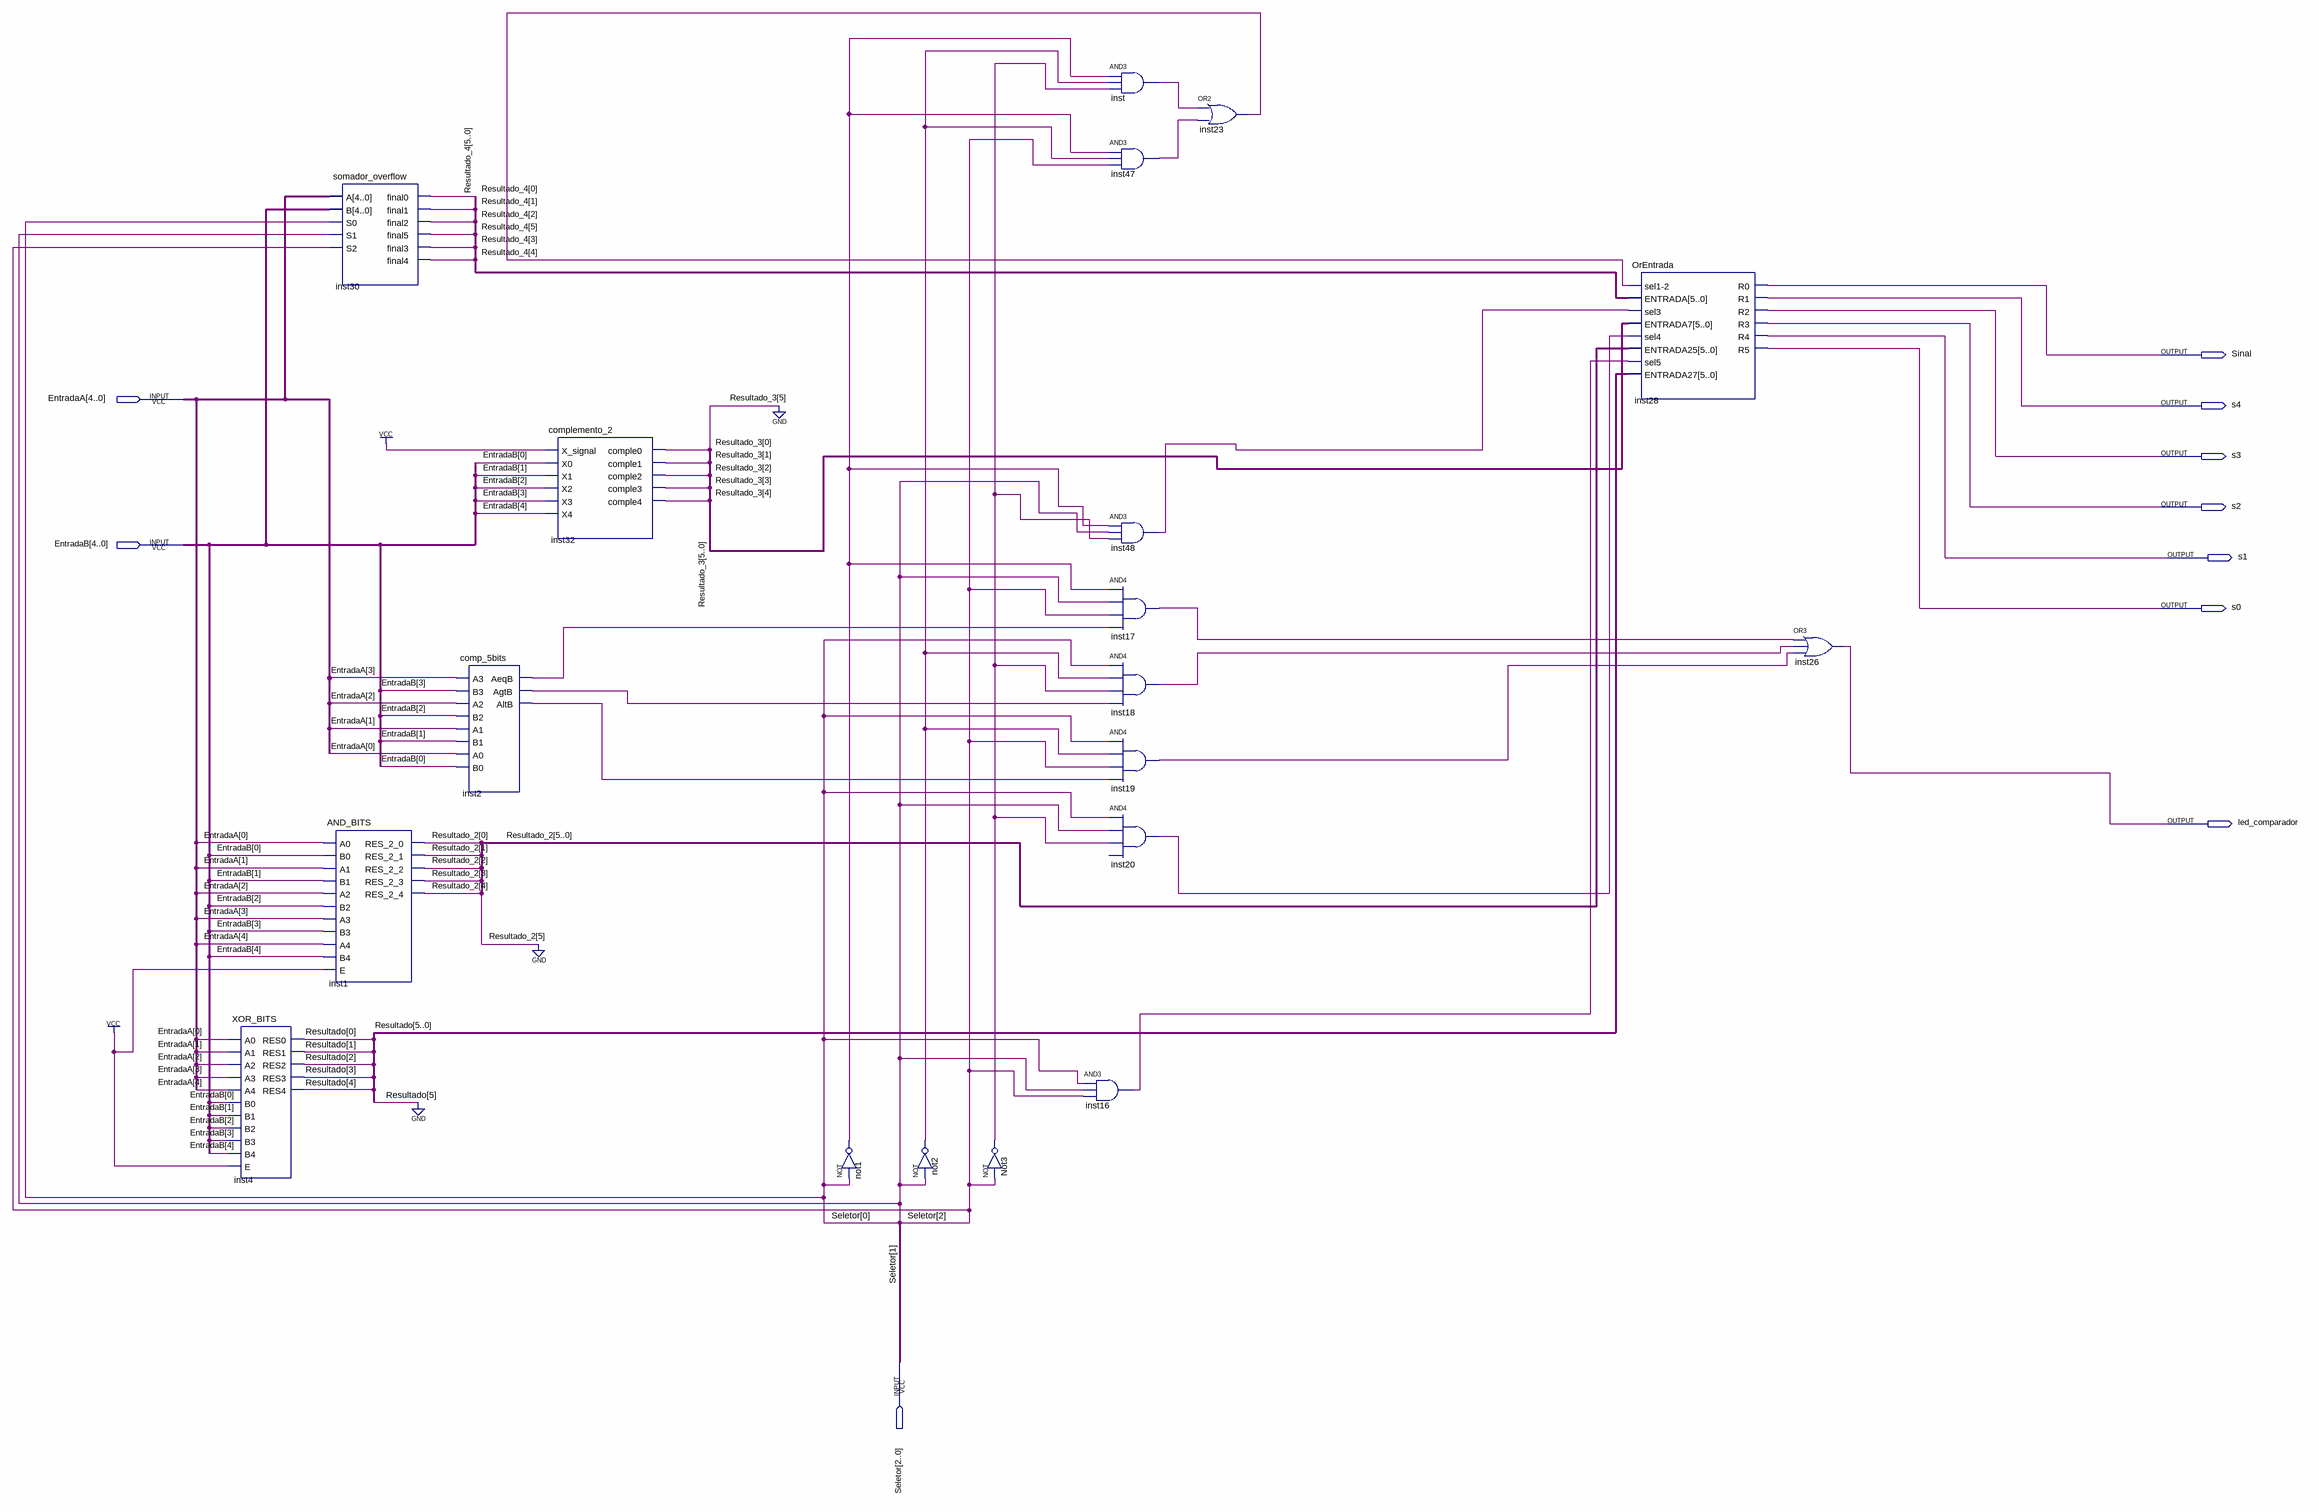
[diagram p0: schematic sheet]
// Quartus schematic ProjetoMux.bdf as structural Verilog: 19 symbols, 10 pins
module ProjetoMux (
  input  [4:0] EntradaA,
  input  [4:0] EntradaB,
  input  [2:0] Seletor,
  output Sinal,
  output s4,
  output s3,
  output s2,
  output s1,
  output s0,
  output led_comparador
);

  wire inst2_aeqb, inst2_agtb, inst2_altb, inst16_out, inst17_out, inst18_out, inst19_out, inst20_out,
       inst23_out, inst47_out, inst48_out, inst_out, not1_out, not2_out, Not3_out;
  wire [4:0] Resultado, Resultado_2, Resultado_3;
  wire [5:0] Resultado_4;

  XOR_BITS inst4 (
    .A0(EntradaA[0]), .A1(EntradaA[1]), .A2(EntradaA[2]), .A3(EntradaA[3]), .A4(EntradaA[4]),
    .B0(EntradaB[0]), .B1(EntradaB[1]), .B2(EntradaB[2]), .B3(EntradaB[3]), .B4(EntradaB[4]), .E(1'b1),
    .RES0(Resultado[0]), .RES1(Resultado[1]), .RES2(Resultado[2]), .RES3(Resultado[3]), .RES4(Resultado[4]));
  somador_overflow inst30 (
    .A(EntradaA), .B(EntradaB), .S0(Seletor[0]), .S1(Seletor[1]), .S2(Seletor[2]), .final0(Resultado_4[0]),
    .final1(Resultado_4[1]), .final2(Resultado_4[2]), .final5(Resultado_4[5]), .final3(Resultado_4[3]),
    .final4(Resultado_4[4]));
  AND_BITS inst1 (
    .A0(EntradaA[0]), .B0(EntradaB[0]), .A1(EntradaA[1]), .B1(EntradaB[1]), .A2(EntradaA[2]),
    .B2(EntradaB[2]), .A3(EntradaA[3]), .B3(EntradaB[3]), .A4(EntradaA[4]), .B4(EntradaB[4]), .E(1'b1),
    .RES_2_0(Resultado_2[0]), .RES_2_1(Resultado_2[1]), .RES_2_2(Resultado_2[2]), .RES_2_3(Resultado_2[3]),
    .RES_2_4(Resultado_2[4]));
  comp_5bits inst2 (
    .A3(EntradaA[3]), .B3(EntradaB[3]), .A2(EntradaA[2]), .B2(EntradaB[2]), .A1(EntradaA[1]),
    .B1(EntradaB[1]), .A0(EntradaA[0]), .B0(EntradaB[0]), .AeqB(inst2_aeqb), .AgtB(inst2_agtb),
    .AltB(inst2_altb));
  complemento_2 inst32 (
    .X_signal(1'b1), .X0(EntradaB[0]), .X1(EntradaB[1]), .X2(EntradaB[2]), .X3(EntradaB[3]),
    .X4(EntradaB[4]), .comple0(Resultado_3[0]), .comple1(Resultado_3[1]), .comple2(Resultado_3[2]),
    .comple3(Resultado_3[3]), .comple4(Resultado_3[4]));
  not not1 (not1_out, Seletor[0]);
  not not2 (not2_out, Seletor[1]);
  not Not3 (Not3_out, Seletor[2]);
  and inst (inst_out, not1_out, not2_out, Not3_out);
  and inst47 (inst47_out, not1_out, not2_out, Seletor[2]);
  and inst48 (inst48_out, not1_out, Seletor[1], Not3_out);
  and inst17 (inst17_out, not1_out, Seletor[1], Seletor[2], inst2_aeqb);
  and inst18 (inst18_out, Seletor[0], not2_out, Not3_out, inst2_agtb);
  and inst19 (inst19_out, Seletor[0], not2_out, Seletor[2], inst2_altb);
  and inst20 (inst20_out, Seletor[0], Seletor[1], Not3_out);  // open: IN4
  and inst16 (inst16_out, Seletor[0], Seletor[1], Seletor[2]);
  or inst23 (inst23_out, inst_out, inst47_out);
  OrEntrada inst28 (
    .\sel1-2 (inst23_out), .ENTRADA(Resultado_4), .sel3(inst48_out), .ENTRADA7({1'b0, Resultado_3}),
    .sel4(inst20_out), .ENTRADA25({1'b0, Resultado_2}), .sel5(inst16_out), .ENTRADA27({1'b0, Resultado}),
    .R0(Sinal), .R1(s4), .R2(s3), .R3(s2), .R4(s1), .R5(s0));
  or inst26 (led_comparador, inst17_out, inst18_out, inst19_out);
endmodule
